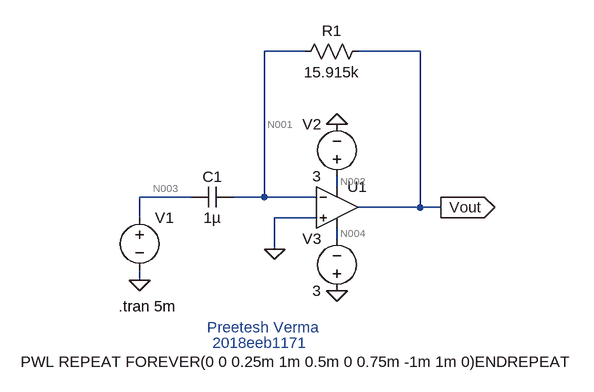
[diagram p0: schematic OpAmp_Differentiator.asc]
OpAmp_Differentiator.asc, the LTspice schematic file:
Version 4
SHEET 1 880 680
WIRE 224 -80 160 -80
WIRE 400 -80 304 -80
WIRE 272 128 272 112
WIRE 48 144 -32 144
WIRE 160 144 160 -80
WIRE 160 144 112 144
WIRE 240 144 160 144
WIRE 400 160 400 -80
WIRE 400 160 304 160
WIRE 432 160 400 160
WIRE -32 176 -32 144
WIRE 240 176 176 176
WIRE 272 208 272 192
WIRE 176 224 176 176
WIRE -32 272 -32 256
FLAG 272 32 0
FLAG 272 288 0
FLAG 176 224 0
FLAG -32 272 0
FLAG 432 160 Vout
IOPIN 432 160 Out
SYMBOL voltage -32 160 R0
WINDOW 3 -183 237 Left 2
WINDOW 123 0 0 Left 0
WINDOW 39 0 0 Left 0
SYMATTR Value PWL REPEAT FOREVER(0 0 0.25m 1m 0.5m 0 0.75m -1m 1m 0)ENDREPEAT
SYMATTR InstName V1
SYMBOL voltage 272 128 R180
WINDOW 0 24 96 Left 2
WINDOW 3 24 16 Left 2
SYMATTR InstName V2
SYMATTR Value 3
SYMBOL voltage 272 304 R180
WINDOW 0 24 96 Left 2
WINDOW 3 24 16 Left 2
SYMATTR InstName V3
SYMATTR Value 3
SYMBOL cap 112 128 R90
WINDOW 0 0 32 VBottom 2
WINDOW 3 32 32 VTop 2
SYMATTR InstName C1
SYMATTR Value 1µ
SYMBOL res 320 -96 R90
WINDOW 0 0 56 VBottom 2
WINDOW 3 32 56 VTop 2
SYMATTR InstName R1
SYMATTR Value 15.915k
SYMBOL Opamps\\UniversalOpamp2 272 160 R0
SYMATTR InstName U1
SYMATTR Value2 Avol=1Meg GBW=100000Meg Slew=10Meg
TEXT -64 312 Left 2 !.tran 5m
TEXT 72 344 Left 2 ;Preetesh Verma
TEXT 80 368 Left 2 ;2018eeb1171

The netlist it stands for:
* OpAmp_Differentiator.asc
V1 N003 0 PWL REPEAT FOREVER(0 0 0.25m 1m 0.5m 0 0.75m -1m 1m 0)ENDREPEAT
V2 N002 0 3
V3 0 N004 3
C1 N001 N003 1µ
R1 Vout N001 15.915k
XU1 0 N001 N002 N004 Vout level.2 Avol=1Meg GBW=100000Meg Slew=10Meg ilimit=25m rail=0 Vos=0 phimargin=45 en=0 enk=0 in=0 ink=0 Rin=500Meg  ; pins IN+ IN- V+ V- OUT
.tran 5m
* Preetesh Verma
* 2018eeb1171
.lib UniversalOpamps2.sub
.backanno
.end

* Results of the author's LTspice run, read from the files saved beside the schematic
* Operating Point, zero values left out:
*   V(n002) = 3 V
*   V(n004) = -3 V
*   I(V3) = -300 µA
*   I(V2) = -300 µA
*   Ix(u1:3) = 300 µA
*   Ix(u1:4) = -300 µA
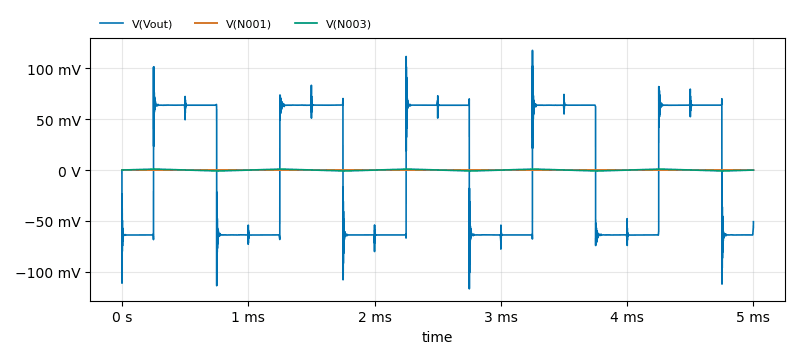
[diagram p1: Transient Analysis of OpAmp_Differentiator.asc, plotted from the saved traces]
* Transient Analysis, 1 run:
*   V(Vout): min -116.5 mV, max 117.4 mV, average -13.88 µV, rms 63.74 mV, last -50.69 mV
*   V(N001): min -769.5 nV, max 818.3 nV, average -56.34 pV, rms 70.46 nV, last 29.76 nV
*   V(N003): min -1 mV, max 1 mV, average 0 V, rms 625.1 µV, last 0 V